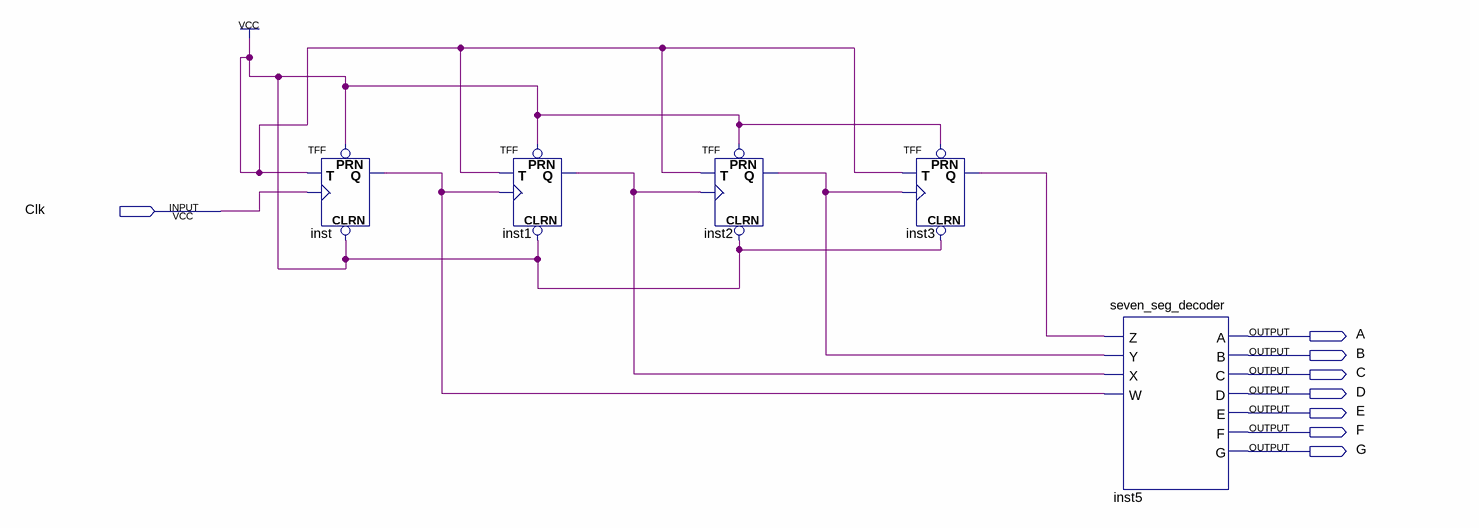
[diagram p0: schematic sheet]
// Quartus schematic lab10step3b.bdf as structural Verilog: 5 symbols, 8 pins
module lab10step3b (
  input  Clk,
  output A,
  output B,
  output C,
  output D,
  output E,
  output F,
  output G
);

  wire inst1_q, inst2_q, inst3_q, inst_q;

  TFF inst (.PRN(1'b1), .CLRN(1'b1), .T(1'b1), .CLK(Clk), .Q(inst_q));
  TFF inst1 (.PRN(1'b1), .CLRN(1'b1), .T(1'b1), .CLK(inst_q), .Q(inst1_q));
  TFF inst2 (.PRN(1'b1), .CLRN(1'b1), .T(1'b1), .CLK(inst1_q), .Q(inst2_q));
  TFF inst3 (.PRN(1'b1), .CLRN(1'b1), .T(1'b1), .CLK(inst2_q), .Q(inst3_q));
  seven_seg_decoder inst5 (
    .Z(inst3_q), .Y(inst2_q), .X(inst1_q), .W(inst_q), .A(A), .B(B), .C(C), .D(D), .E(E), .F(F), .G(G));
endmodule
